# Altium schematic sheet 5V_Load_Switches.SchDoc
size A4; SheetNumber: 14; SheetTotal: 18
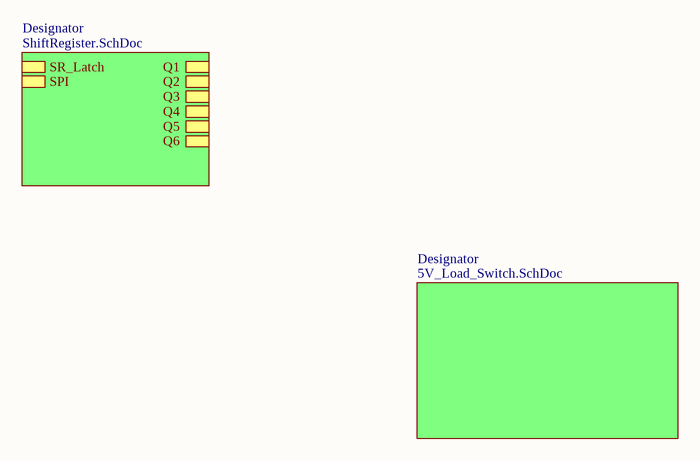
[diagram p0: 5V_Load_Switches.SchDoc]

## Sub-sheets
Designator = ShiftRegister.SchDoc: SPI (harness SPI), SR_Latch, Q1, Q2, Q3, Q4, Q5, Q6
Designator = 5V_Load_Switch.SchDoc: no entries